# Altium schematic sheet DRIVER.SchDoc: Output Driver
size A3; Author: eldar6776@hotmail.com; DrawnBy: Eldar Dedić; Organization: PROVEN d.o.o.; Address1: Adema Buće 102; Address2: 71000 Sarajevo; Address3: Federacija BiH; Address4: Bosna i Hercegovina; DocumentNumber: DE091114; Revision: 001; SheetNumber: 2; SheetTotal: 2; ProjectName: ABSOLUT_ENCODER
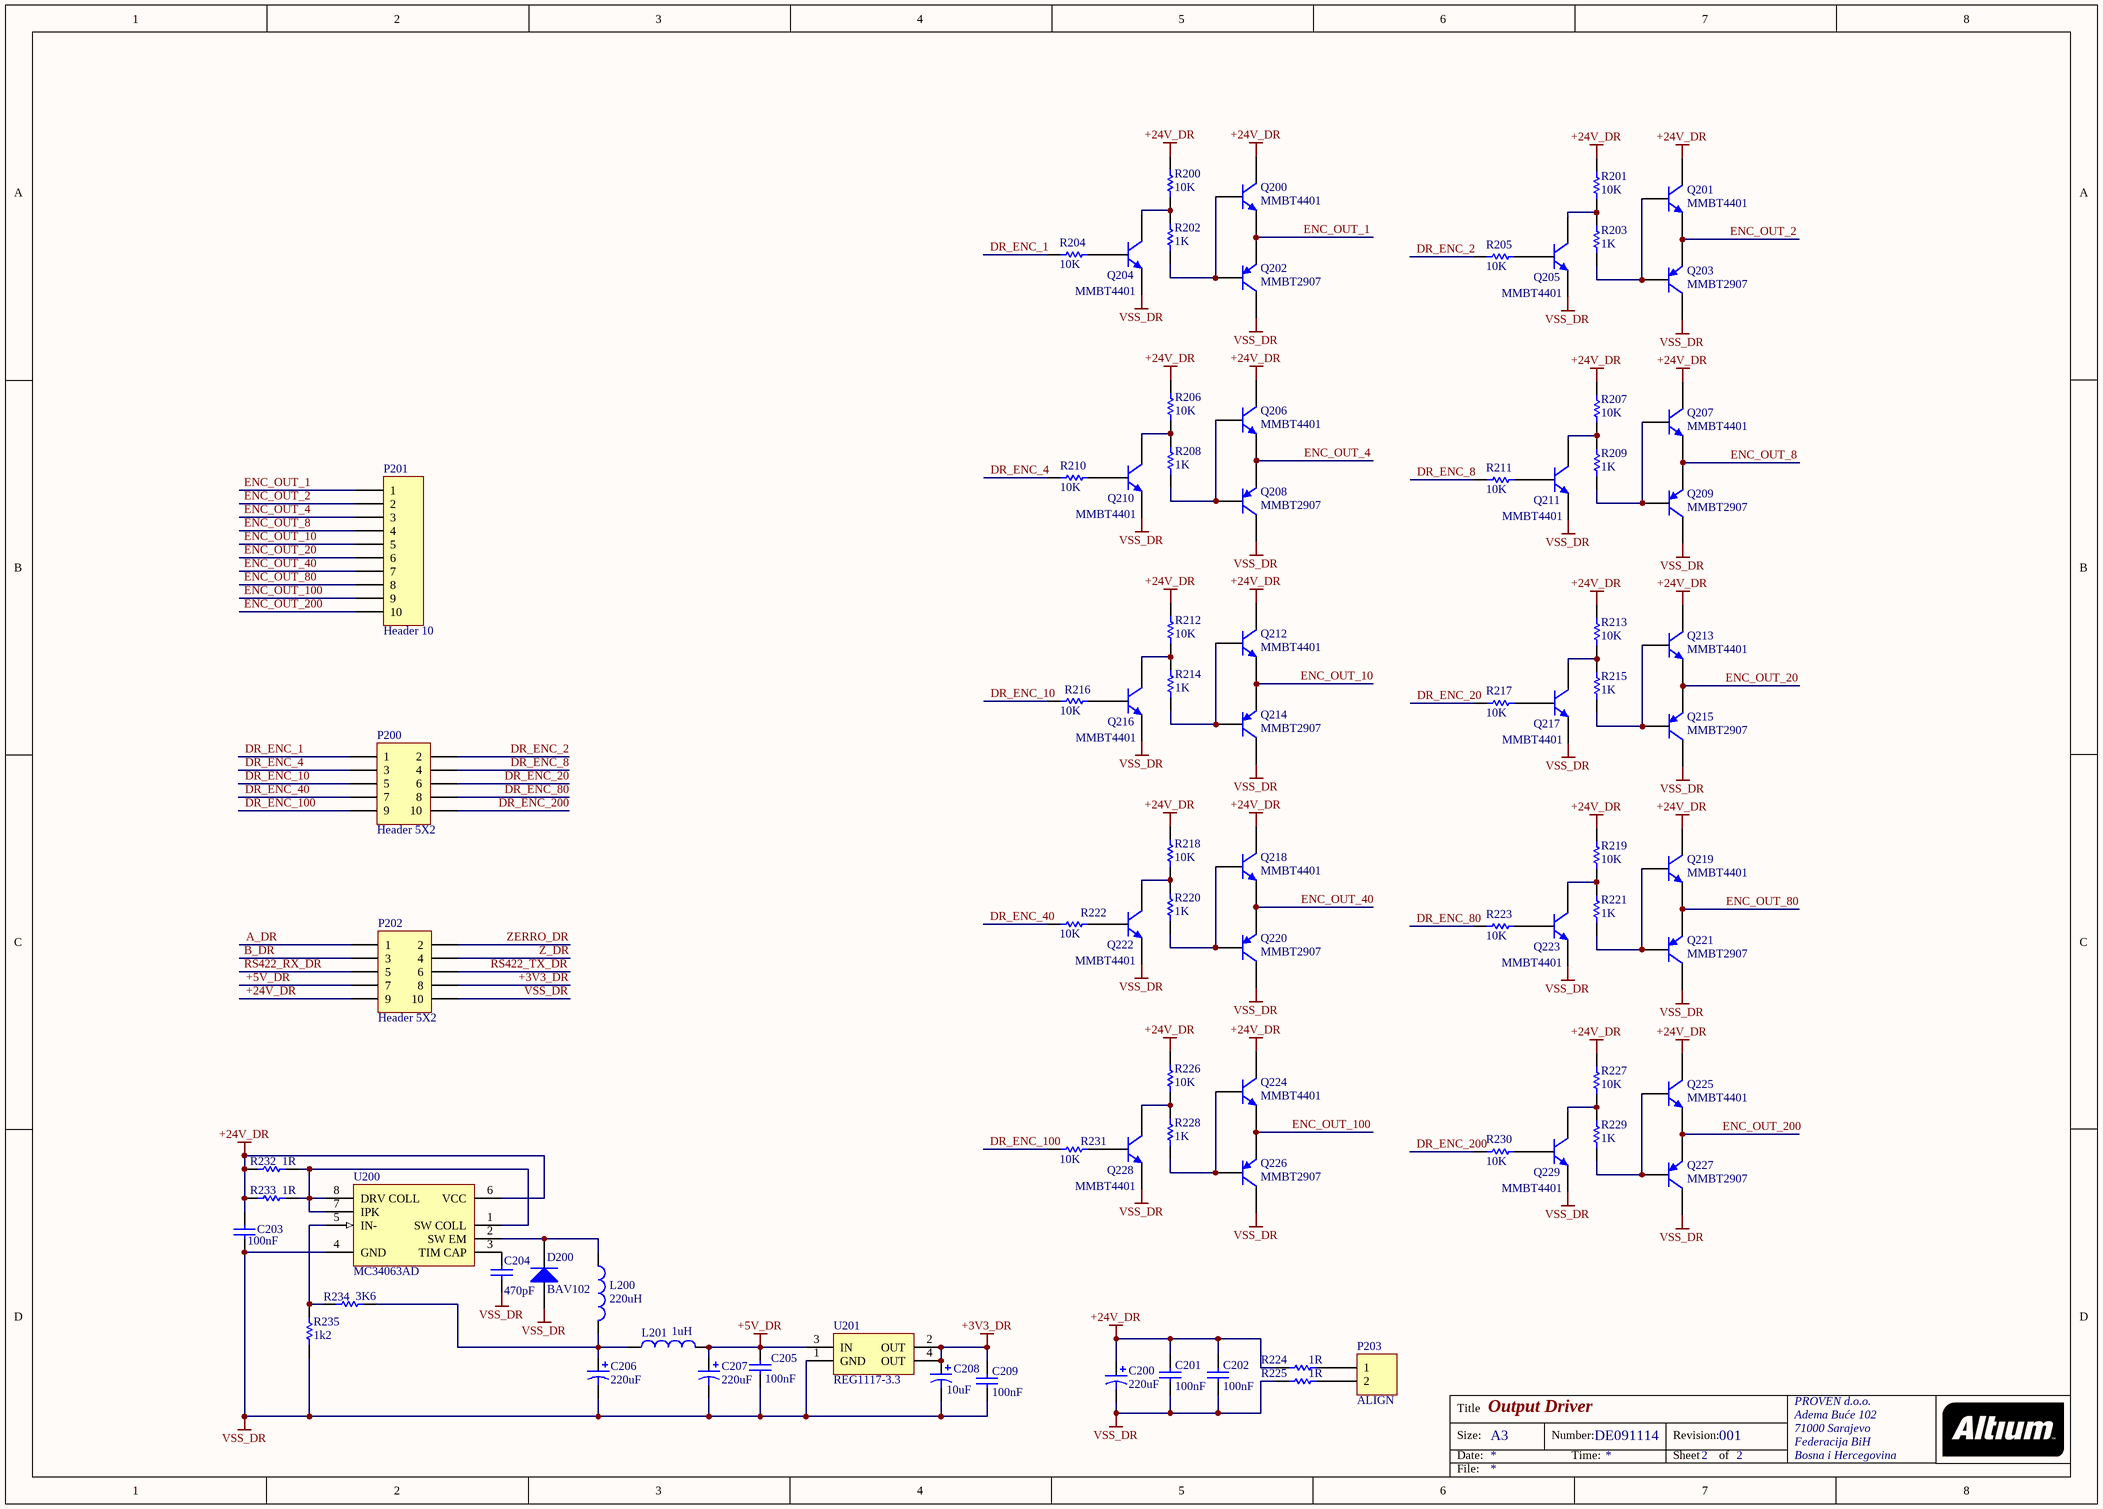
[diagram p0: DRIVER.SchDoc]

## Parts
C200  220uF  [E]
C201  value 100nF  [0805]
C202  value 100nF  [0805]
C203  value 100nF  [1206]
C204  value 470pF  [0805]
C205  value 100nF  [0805]
C206  220uF  [CAPPR2-5X11]
C207  220uF  [CAPPR2-5X11]
C208  10uF  [49BC-C]
C209  value 100nF  [0805]
D200  BAV102  [SOD80C]
L200  value 220uH  [RB5-10.5]
L201  value 1uH  [RB5-10.5]
P200  Header 5X2  [HDR2X5]
P201  Header 10  [HDR1X10]
P202  Header 5X2  [HDR2X5]
P203  ALIGN  [HDR1X2]
Q200  MMBT4401  [SOT23_N]
Q201  MMBT4401  [SOT23_N]
Q202  MMBT2907  [SOT23_N]
Q203  MMBT2907  [SOT23_N]
Q204  MMBT4401  [SOT23_N]
Q205  MMBT4401  [SOT23_N]
Q206  MMBT4401  [SOT23_N]
Q207  MMBT4401  [SOT23_N]
Q208  MMBT2907  [SOT23_N]
Q209  MMBT2907  [SOT23_N]
Q210  MMBT4401  [SOT23_N]
Q211  MMBT4401  [SOT23_N]
Q212  MMBT4401  [SOT23_N]
Q213  MMBT4401  [SOT23_N]
Q214  MMBT2907  [SOT23_N]
Q215  MMBT2907  [SOT23_N]
Q216  MMBT4401  [SOT23_N]
Q217  MMBT4401  [SOT23_N]
Q218  MMBT4401  [SOT23_N]
Q219  MMBT4401  [SOT23_N]
Q220  MMBT2907  [SOT23_N]
Q221  MMBT2907  [SOT23_N]
Q222  MMBT4401  [SOT23_N]
Q223  MMBT4401  [SOT23_N]
Q224  MMBT4401  [SOT23_N]
Q225  MMBT4401  [SOT23_N]
Q226  MMBT2907  [SOT23_N]
Q227  MMBT2907  [SOT23_N]
Q228  MMBT4401  [SOT23_N]
Q229  MMBT4401  [SOT23_N]
R200  10K  [ERA-0603]
R201  10K  [ERA-0603]
R202  1K  [ERA-0603]
R203  1K  [ERA-0603]
R204  10K  [ERA-0603]
R205  10K  [ERA-0603]
R206  10K  [ERA-0603]
R207  10K  [ERA-0603]
R208  1K  [ERA-0603]
R209  1K  [ERA-0603]
R210  10K  [ERA-0603]
R211  10K  [ERA-0603]
R212  10K  [ERA-0603]
R213  10K  [ERA-0603]
R214  1K  [ERA-0603]
R215  1K  [ERA-0603]
R216  10K  [ERA-0603]
R217  10K  [ERA-0603]
R218  10K  [ERA-0603]
R219  10K  [ERA-0603]
R220  1K  [ERA-0603]
R221  1K  [ERA-0603]
R222  10K  [ERA-0603]
R223  10K  [ERA-0603]
R224  1R  [ERA-0603]
R225  1R  [ERA-0603]
R226  10K  [ERA-0603]
R227  10K  [ERA-0603]
R228  1K  [ERA-0603]
R229  1K  [ERA-0603]
R230  10K  [ERA-0603]
R231  10K  [ERA-0603]
R232  1R  [ERA-0805]
R233  1R  [ERA-0805]
R234  3K6  [ERA-0805]
R235  1k2  [ERA-0805]
U200  MC34063AD  [751-05_N]
U201  REG1117-3.3  [ZZ311]

## Nets
+3V3_DR: C208.1 C209.2 P202.8 U201.2(OUT) U201.4(OUT)
+5V_DR: C205.2 C207.1 L201.2 P202.7 U201.3(IN)
+24V_DR: C200.1 C201.2 C202.2 C203.2 P202.9 Q200.3(C) Q201.3(C) Q206.3(C) Q207.3(C) Q212.3(C) Q213.3(C) Q218.3(C) Q219.3(C) Q224.3(C) Q225.3(C) R200.1 R201.1 R206.1 R207.1 R212.1 R213.1 R218.1 R219.1 R224.1 R226.1 R227.1 R232.1 R233.1 U200.6(VCC)
VSS_DR: C200.2 C201.1 C202.1 C203.1 C204.1 C205.1 C206.2 C207.2 C208.2 C209.1 D200.1(A) P202.10 Q202.3(C) Q203.3(C) Q204.2(E) Q205.2(E) Q208.3(C) Q209.3(C) Q210.2(E) Q211.2(E) Q214.3(C) Q215.3(C) Q216.2(E) Q217.2(E) Q220.3(C) Q221.3(C) Q222.2(E) Q223.2(E) Q226.3(C) Q227.3(C) Q228.2(E) Q229.2(E) R225.1 R235.1 U200.4(GND) U201.1(GND)
A_DR: P202.1
B_DR: P202.3
DR_ENC_1: P200.1 R204.2
DR_ENC_2: P200.2 R205.2
DR_ENC_4: P200.3 R210.2
DR_ENC_8: P200.4 R211.2
DR_ENC_10: P200.5 R216.2
DR_ENC_20: P200.6 R217.2
DR_ENC_40: P200.7 R222.2
DR_ENC_80: P200.8 R223.2
DR_ENC_100: P200.9 R231.2
DR_ENC_200: P200.10 R230.2
ENC_OUT_1: P201.1 Q200.2(E) Q202.2(E)
ENC_OUT_2: P201.2 Q201.2(E) Q203.2(E)
ENC_OUT_4: P201.3 Q206.2(E) Q208.2(E)
ENC_OUT_8: P201.4 Q207.2(E) Q209.2(E)
ENC_OUT_10: P201.5 Q212.2(E) Q214.2(E)
ENC_OUT_20: P201.6 Q213.2(E) Q215.2(E)
ENC_OUT_40: P201.7 Q218.2(E) Q220.2(E)
ENC_OUT_80: P201.8 Q219.2(E) Q221.2(E)
ENC_OUT_100: P201.9 Q224.2(E) Q226.2(E)
ENC_OUT_200: P201.10 Q225.2(E) Q227.2(E)
RS422_RX_DR: P202.5
RS422_TX_DR: P202.6
Z_DR: P202.4
ZERRO_DR: P202.2
NetC204_2: C204.2 U200.3(TIM_CAP)
NetC206_1: C206.1 L200.2 L201.1 R234.2
NetD200_2: D200.2(K) L200.1 U200.2(SW_EM)
NetP203_1: P203.1 R224.2
NetP203_2: P203.2 R225.2
NetQ200_1: Q200.1(B) Q202.1(B) R202.1
NetQ201_1: Q201.1(B) Q203.1(B) R203.1
NetQ204_1: Q204.1(B) R204.1
NetQ204_3: Q204.3(C) R200.2 R202.2
NetQ205_1: Q205.1(B) R205.1
NetQ205_3: Q205.3(C) R201.2 R203.2
NetQ206_1: Q206.1(B) Q208.1(B) R208.1
NetQ207_1: Q207.1(B) Q209.1(B) R209.1
NetQ210_1: Q210.1(B) R210.1
NetQ210_3: Q210.3(C) R206.2 R208.2
NetQ211_1: Q211.1(B) R211.1
NetQ211_3: Q211.3(C) R207.2 R209.2
NetQ212_1: Q212.1(B) Q214.1(B) R214.1
NetQ213_1: Q213.1(B) Q215.1(B) R215.1
NetQ216_1: Q216.1(B) R216.1
NetQ216_3: Q216.3(C) R212.2 R214.2
NetQ217_1: Q217.1(B) R217.1
NetQ217_3: Q217.3(C) R213.2 R215.2
NetQ218_1: Q218.1(B) Q220.1(B) R220.1
NetQ219_1: Q219.1(B) Q221.1(B) R221.1
NetQ222_1: Q222.1(B) R222.1
NetQ222_3: Q222.3(C) R218.2 R220.2
NetQ223_1: Q223.1(B) R223.1
NetQ223_3: Q223.3(C) R219.2 R221.2
NetQ224_1: Q224.1(B) Q226.1(B) R228.1
NetQ225_1: Q225.1(B) Q227.1(B) R229.1
NetQ228_1: Q228.1(B) R231.1
NetQ228_3: Q228.3(C) R226.2 R228.2
NetQ229_1: Q229.1(B) R230.1
NetQ229_3: Q229.3(C) R227.2 R229.2
NetR232_2: R232.2 R233.2 U200.1(SW_COLL) U200.7(IPK) U200.8(DRV_COLL)
NetR234_1: R234.1 R235.2 U200.5(IN-)

## Notes on the sheet
- Title
- Size:
- Date:
- A3
- Number:
- Time:
- Revision:
- Sheet
- of
- File:

## Library data of the parts
C200 = 94SS107X0020EBP: Solid Aluminum Capacitor with Organic Semiconductor Electrolyte: 100uF, 20V, Bulk Pack; Note: Part Numbers shown are for ± 20% capacitance tolerance (X0).; PCB_Layout: Complies with Manufacturer's Recommendation.; DrillSize: Nominal, Rounded to the nearest 0.1mm; Published: 19-Mar-2004; DatasheetDocument: 23-May-2001; PackageReference: E; Publisher: Altium Limited; ComponentLink1Description: Manufacturer Link; ComponentLink1URL: http://www.vishay.com/; ComponentLink2Description: Datasheet; ComponentLink2URL: http://www.vishay.com/docs/90008/94ss.pdf; Value: 100uF
C201 C202 C204 C205 C209 = C0805: Ceramic Chip Capacitor - Standard; Note: Footprint corresponds to dimensions for bulk cassette packaging. This case size has tightened tolerances.; Published: 17-Jul-2002; LatestRevisionDate: 19-Mar-2004; LatestRevisionNote: Silkscreen size reduced.; DatasheetDocument: Mar-2001; PackageDocument: Mar-2001; PackageReference: 0805; Publisher: Altium Limited; Code_JEITA: 0805; Code_IPC: 2012[0805]; ComponentLink1Description: Manufacturer Link; ComponentLink1URL: http://www.kemet.com/; ComponentLink2Description: Datasheet; ComponentLink2URL: http://www.kemet.com/kemet/web/homepage/kechome.nsf/vapubfilesname/F3102TA.pdf/$file/F3102TA.pdf
C203 = C1206: Ceramic Chip Capacitor - Standard; Published: 17-Jul-2002; LatestRevisionDate: 19-Mar-2004; LatestRevisionNote: Silkscreen size reduced.; DatasheetDocument: Mar-2001; PackageDocument: Mar-2001; PackageReference: 1206; Publisher: Altium Limited; Code_JEITA: 1206; Code_IPC: 3216 [1206]; ComponentLink1Description: Manufacturer Link; ComponentLink1URL: http://www.kemet.com/; ComponentLink2Description: Datasheet; ComponentLink2URL: http://www.kemet.com/kemet/web/homepage/kechome.nsf/vapubfilesname/F3102TA.pdf/$file/F3102TA.pdf
C206 C207 = EKA00AA322C00: Aluminum Electrolytic Capacitor, Radial Style with Long Leads: 220uF, 10V; Note: Refer to Manufacturer's Data Sheets for other lead formations; DrillSize: Nominal, Rounded To The Nearest 0.1mm; Published: 19-Mar-2004; DatasheetDocument: 20-Feb-2001; PackageReference: CAPPR2-5X11; Publisher: Altium Limited; ComponentLink1Description: Manufacturer Link; ComponentLink1URL: http://www.vishay.com/; ComponentLink2Description: Datasheet; ComponentLink2URL: http://www.vishay.com/docs/25014/eka.pdf; Value: 220uF
C208 = 49BC685B010M: Conformal Coated Solid Tantalum Chip Capacitor: 6.8uF, 20% Tolerance, 10 WVDC @ -55°C to +85°C, Surge = 13V; Note: See Data Sheet for full range of components; Published: 19-Mar-2004; DatasheetDocument: 05-Jul-2002; PackageReference: 49BC-C; Publisher: Altium Limited; ComponentLink1Description: Manufacturer Link; ComponentLink1URL: http://www.vishay.com/; Value: 6.8uF
D200 = BAV102: General-purpose Diode; Published: 17-Sep-2003; LatestRevisionDate: 19-Mar-2004; LatestRevisionNote: Silkscreen size reduced.; DatasheetVersion: 17-Sep-1996; PackageVersion: Jan-2002; PackageReference: SOD80C; Publisher: Altium Limited; PackageDescription: Metal Electrode Face (MELF) Diode; Body 3.5 x 1.6 mm (LxDia); ComponentLink1Description: Manufacturer Link; ComponentLink1URL: http://www.semiconductors.philips.com/; ComponentLink2Description: Datasheet; ComponentLink2URL: http://www.semiconductors.philips.com/acrobat/datasheets/BAV100_2.pdf
L200 L201 = PCMC063T-R82MN: SMT Power Choke Coil; Size 7.3×6.6×3.0mm, ±20% Tolerance, 0.82uH, 13A; PCB_Layout: Complies with manufacturer's recommendation.; Published: 26-Sep-2008; DatasheetVersion: Oct-2007; PackageVersion: Oct-2007; PackageReference: PCMC063T; Publisher: Altium Limited; PackageDescription: SM Power Choke Coil; 2 Leads; Body 7.3 x 6.6 x 3.0 mm (LxWxH); ComponentLink1Description: Manufacturer Link; ComponentLink1URL: http://www.susumu.co.jp/; ComponentLink2Description: Datasheet; ComponentLink2URL: http://www.susumu.co.jp/english/pdf/products-j07-01.pdf
P200 P202 = Header 5X2: Header, 5-Pin, Dual row; LatestRevisionDate: 17-Jul-2002; LatestRevisionNote: Re-released for DXP Platform.; Publisher: Altium Limited
P201 = Header 10: Header, 10-Pin; LatestRevisionDate: 17-Jul-2002; LatestRevisionNote: Re-released for DXP Platform.; Publisher: Altium Limited
P203 = Header 2: Header, 2-Pin; LatestRevisionDate: 17-Jul-2002; LatestRevisionNote: Re-released for DXP Platform.; Publisher: Altium Limited
Q200 Q201 Q204-Q207 Q210-Q213 Q216-Q219 Q222-Q225 Q228 Q229 = BC817-16: NPN General-purpose Transistor; Published: 17-Sep-2003; LatestRevisionDate: 12-Dec-2006; LatestRevisionNote: IPC-7351 Footprint Added.; DatasheetVersion: Jun-1999; PackageVersion: May-1999; PackageReference: SOT23; Publisher: Altium Limited; PackageDescription: 3-Pin SOT-23 Package 0.95 mm Pitch, 2.3 mm Lead Span; ComponentLink1Description: Manufacturer Link; ComponentLink1URL: http://www.semiconductors.philips.com/; ComponentLink2Description: Datasheet; ComponentLink2URL: http://www.semiconductors.philips.com/acrobat/datasheets/BC817_BC817W_BC337_5.pdf
Q202 Q203 Q208 Q209 Q214 Q215 Q220 Q221 Q226 Q227 = BC807-16: PNP General-purpose Transistor; Published: 17-Sep-2003; LatestRevisionDate: 12-Dec-2006; LatestRevisionNote: IPC-7351 Footprint Added.; DatasheetVersion: 8-Apr-1999; PackageVersion: May-1999; PackageReference: SOT23; Publisher: Altium Limited; PackageDescription: 3-Pin SOT-23 Package 0.95 mm Pitch, 2.3 mm Lead Span; ComponentLink1Description: Manufacturer Link; ComponentLink1URL: http://www.semiconductors.philips.com/; ComponentLink2Description: Datasheet; ComponentLink2URL: http://www.semiconductors.philips.com/acrobat/datasheets/BC807_BC807W_BC327_5.pdf
R200-R231 = ERAV: Metal Film Thermosensitive Chip Resistor, 0.56 Ohm to 10k Ohm Range, 5% Tolerance, 0603 Size, 0.063 W; Note: If flow soldering, adjust pad width of PCB Footprint to 0.7 - 0.8 times the width of the resistor.; Published: 17-Dec-2003; LatestRevisionDate: 19-Mar-2004; LatestRevisionNote: Silkscreen size reduced.; PackageDocument: Mar-2003; PackageReference: ERA-0603; Publisher: Altium Limited; Code_IPC: 1608 [0603]; ComponentLink1Description: Manufacturer Link; ComponentLink1URL: http://www.panasonic.com/industrial/components/resistive_products.htm; ComponentLink2Description: Datasheet; ComponentLink2URL: http://www.panasonic.com/industrial/components/pdf/AOF0000CE1.pdf
R232-R235 = ERAS: Metal Film Thermosensitive Chip Resistor, 0.56 Ohm to 10k Ohm Range, 5% Tolerance, 0805 Size, 0.1 W; Note: If flow soldering, adjust pad width of PCB Footprint to 0.7 - 0.8 times the width of the resistor.; Published: 17-Dec-2003; LatestRevisionDate: 19-Mar-2004; LatestRevisionNote: Silkscreen size reduced.; PackageDocument: Mar-2003; PackageReference: ERA-0805; Publisher: Altium Limited; Code_IPC: 2012 [0805]; ComponentLink1Description: Manufacturer Link; ComponentLink1URL: http://www.panasonic.com/industrial/components/resistive_products.htm; ComponentLink2Description: Datasheet; ComponentLink2URL: http://www.panasonic.com/industrial/components/pdf/AOF0000CE1.pdf
U200 = MC34063AD: DC-to-DC Converter Control Circuit; Published: 15-Apr-2002; LatestRevisionDate: 13-Apr-2006; LatestRevisionNote: IPC-7351 Footprint Added.; DatasheetVersion: 1996; PackageVersion: 1998; PackageReference: 751-05; Publisher: Altium Limited; PackageDescription: 8-Pin Small Outline Integrated Circuit 1.27 mm Pitch; Code_JEDEC: MS-012-AA; Code_IPC: SOIC127P600-8; ComponentLink1Description: Manufacturer Link; ComponentLink1URL: http://www.onsemi.com/site/products/taxonomy/0,4438,503,00.html; ComponentLink2Description: Datasheet; ComponentLink2URL: http://www.onsemi.com/pub/Collateral/MC34063A-D.PDF
U201 = REG1117-3.3: 800mA and 1A Low Dropout Positive Regulator 2.85V, 3.3V, 5V, and Adjustable; Published: 8-Jun-2000; LatestRevisionDate: 17-Jul-2002; LatestRevisionNote: Re-released for DXP Platform.; DatasheetVersion: Sep-1997; PackageVersion: revC; PackageReference: ZZ311; Publisher: Altium Limited; PackageDescription: SOT-223/SC-73; 4 Leads; Body 6.7 x 7.3 mm, inc. leads (LxW max); ComponentLink1Description: Manufacturer Link; ComponentLink1URL: http://www.ti.com/; ComponentLink2Description: Datasheet; ComponentLink2URL: http://www-s.ti.com/sc/ds/REG1117.pdf